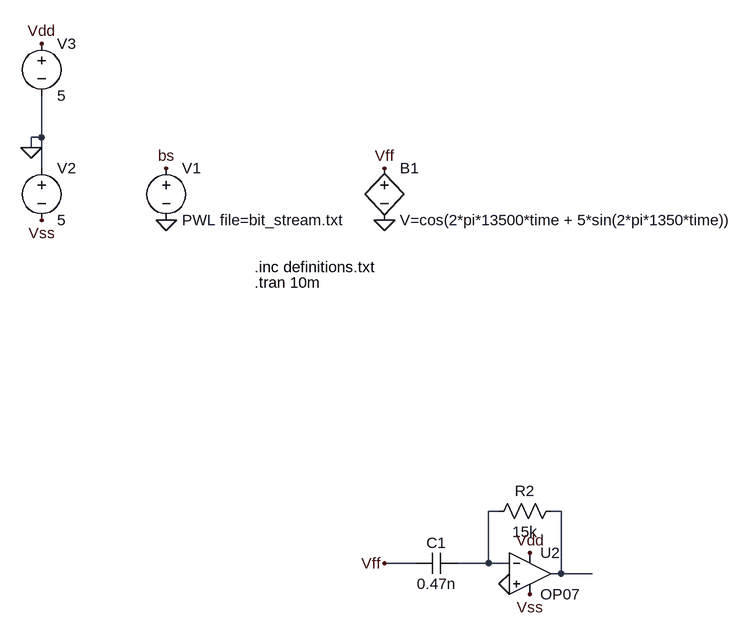
[diagram p0: schematic PLL_PM.asc]
PLL_PM.asc, the LTspice schematic file:
Version 4
SHEET 1 880 680
WIRE -352 -320 -352 -384
WIRE -352 -320 -368 -320
WIRE -368 -304 -368 -320
WIRE -352 -272 -352 -320
WIRE 352 256 336 256
WIRE 448 256 432 256
WIRE 224 336 176 336
WIRE 336 336 336 256
WIRE 336 336 288 336
WIRE 368 336 336 336
WIRE 448 352 448 256
WIRE 448 352 432 352
WIRE 496 352 448 352
FLAG 176 -192 0
FLAG 176 -272 Vff
FLAG -160 -192 0
FLAG -160 -272 bs
FLAG -352 -464 Vdd
FLAG -352 -192 Vss
FLAG -368 -304 0
FLAG 400 320 Vdd
FLAG 400 384 Vss
FLAG 176 336 Vff
FLAG 368 368 0
SYMBOL bv 176 -288 R0
SYMATTR InstName B1
SYMATTR Value V=cos(2*pi*13500*time + 5*sin(2*pi*1350*time))
SYMBOL voltage -160 -288 R0
WINDOW 123 0 0 Left 0
WINDOW 39 0 0 Left 0
SYMATTR InstName V1
SYMATTR Value PWL file=bit_stream.txt
SYMBOL voltage -352 -288 R0
WINDOW 123 0 0 Left 0
WINDOW 39 0 0 Left 0
SYMATTR InstName V2
SYMATTR Value 5
SYMBOL voltage -352 -480 R0
WINDOW 123 0 0 Left 0
WINDOW 39 0 0 Left 0
SYMATTR InstName V3
SYMATTR Value 5
SYMBOL OpAmps\\OP07 400 288 R0
SYMATTR InstName U2
SYMBOL cap 288 320 R90
WINDOW 0 0 32 VBottom 2
WINDOW 3 32 32 VTop 2
SYMATTR InstName C1
SYMATTR Value 0.47n
SYMBOL res 448 240 R90
WINDOW 0 0 56 VBottom 2
WINDOW 3 32 56 VTop 2
SYMATTR InstName R2
SYMATTR Value 15k
TEXT -24 -96 Left 2 !.tran 10m
TEXT -24 -120 Left 2 !.inc definitions.txt

The netlist it stands for:
* PLL_PM.asc
B1 Vff 0 V=cos(2*pi*13500*time + 5*sin(2*pi*1350*time))
V1 bs 0 PWL file=bit_stream.txt
V2 0 Vss 5
V3 Vdd 0 5
XU2 0 N001 Vdd Vss N002 LT1001  ; OP07, pins In+ In- V+ V- OUT
C1 N001 Vff 0.47n
R2 N002 N001 15k
.tran 10m
.inc definitions.txt
.lib LTC.lib
.backanno
.end